# Altium schematic sheet StepperLogic.SchDoc
size A4
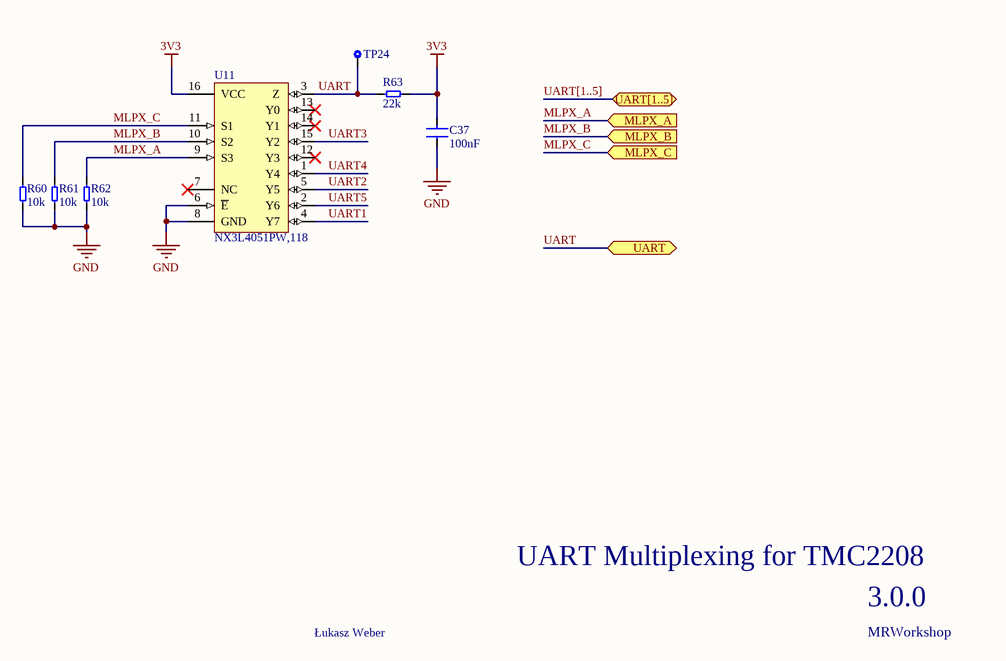
[diagram p0: StepperLogic.SchDoc]

## Parts
C37  value 100nF  [C_0402]  (hidden comment: GRM155R61A104KA01J)
R60  value 10k  [R_0402]  (hidden comment: CR0402-FX-1002GLF)
R61  value 10k  [R_0402]  (hidden comment: CR0402-FX-1002GLF)
R62  value 10k  [R_0402]  (hidden comment: CR0402-FX-1002GLF)
R63  value 22k  [R_0402]  (hidden comment: CR0402-FX-2202GLF)
TP24  TestPoint_1mm  [TestPoint_1mm]  (value not drawn)
U11  NX3L4051PW,118  [TSSOP16]

## Ports
MLPX_A (in), MLPX_B (in), MLPX_C (in), UART (bidir), UART[1..5] (bidir)

## Nets
3V3: C37.2 R63.1 U11.16(VCC)
GND: C37.1 R60.1 R61.1 R62.1 U11.6(~{E}) U11.8(GND)
MLPX_A: R62.2 U11.9(S3) ; port MLPX_A
MLPX_B: R61.2 U11.10(S2) ; port MLPX_B
MLPX_C: R60.2 U11.11(S1) ; port MLPX_C
UART: R63.2 TP24.1 U11.3(Z) ; port UART
UART1: U11.4(Y7)
UART2: U11.5(Y5)
UART3: U11.15(Y2)
UART4: U11.1(Y4)
UART5: U11.2(Y6)

Not connected (* = marked no-connect by the designer): U11 7(NC)* 12(Y3)* 13(Y0)* 14(Y1)*

## Buses and harness runs
bus UART[1..5] = port UART[1..5]

## Notes on the sheet
- UART Multiplexing for TMC2208
- 3.0.0
- Łukasz Weber
- MRWorkshop

## Library data of the parts
C37 = GRM155R61A104KA01J: Multilayer Ceramic Capacitors MLCC - SMD/SMT 0.1 uF 10 VDC 10% 0402 X5R; Voltage: 10V; Supplier 1: Mouser; Supplier Part Number 1: 81-GRM15R61A104KA01J; Tolerance: 10%
R60-R62 = CR0402-FX-1002GLF: Thick Film Resistors - SMD 10K OHM 1%; Supplier 1: Farnell; Supplier Part Number 1: 2333566
R63 = CR0402-FX-2202GLF: Thick Film Resistors - SMD 22K OHM 1%; Power: 62.5mW; Voltage: 50V; Supplier 1: Rs; Supplier Part Number 1: 2477003; Tolerance: 1%
U11 = NX3L4051PW,118: Analogue Switch ICs ANLG SWT SPST 3.3V; Supplier 1: Farnell; Supplier Part Number 1: 2775927